# Altium schematic sheet USB To Serial.SchDoc
size A
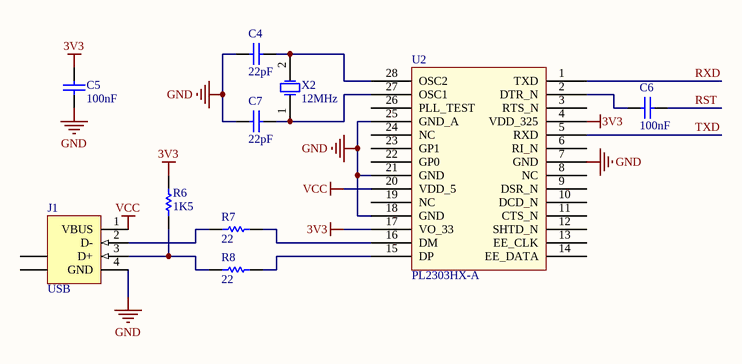
[diagram p0: USB To Serial.SchDoc]

## Parts
C4  22pF  [C0805]
C5  100nF  [C0805]
C6  100nF  [C0805]
C7  22pF  [C0805]
J1  USB  [HDR1X4]
R6  1K5  [R0805]
R7  22  [R0805]
R8  22  [R0805]
U2  PL2303HX-A  [SSOP-28]
X2  12MHz  [HC49US]

## Nets
3V3: C5.2 R6.2 U2.4(VDD_325) U2.17(VO_33)
GND: C4.1 C5.1 C7.1 J1.4(GND) U2.7(GND) U2.18(GND) U2.21(GND) U2.25(GND_A)
VCC: J1.1(VBUS) U2.20(VDD_5)
RST: C6.1
RXD: U2.1(TXD)
TXD: U2.5(RXD)
NetC4_2: C4.2 U2.28(OSC2) X2.2(OSC2)
NetC6_2: C6.2 U2.2(DTR_N)
NetC7_2: C7.2 U2.27(OSC1) X2.1(OSC1)
NetJ1_2: J1.2(D-) R7.1
NetJ1_3: J1.3(D+) R6.1 R8.1
NetR7_2: R7.2 U2.16(DM)
NetR8_2: R8.2 U2.15(DP)

Not connected (* = marked no-connect by the designer): J1 5(SHLD) 6(SHLD); U2 3(RTS_N) 6(RI_N) 8(NC) 9(DSR_N) 10(DCD_N) 11(CTS_N) 12(SHTD_N) 13(EE_CLK) 14(EE_DATA) 19(NC) 22(GP0) 23(GP1) 24(NC) 26(PLL_TEST)

## Library data of the parts
C4-C7 = Cap: Capacitor; Published: 8-Jun-2000; LatestRevisionDate: 17-Jul-2002; LatestRevisionNote: Re-released for DXP Platform.; PackageReference: RAD-0.3; Publisher: Altium Limited; PackageDescription: Radial Cap, Thru-Hole; 2 Leads; 0.3 in Pin Spacing
  C4 C7: Value: 22pF
  C5 C6: Value: 100nF
J1 = USB: Value: Type B; Category: Connector; Type: USB; Price: 2250; Link: http://www.sfe-electronics.com/product.php?category=12&product_id=156
R6-R8 = Res1: Resistor; Published: 8-Jun-2000; LatestRevisionDate: 17-Jul-2002; LatestRevisionNote: Re-released for DXP Platform.; PackageReference: AXIAL-0.3; Publisher: Altium Limited; PackageDescription: Axial Device, Thru-Hole; 2 Leads; 0.3 in Pin Spacing
  R6: Value: 1K5
  R7 R8: Value: 22
U2 = PL2303HX Rev. A: Value: PL2303HX-A
X2 = XTAL: Crystal Oscillator; Published: 8-Jun-2000; LatestRevisionDate: 17-Jul-2002; LatestRevisionNote: Re-released for DXP Platform.; PackageReference: R38; Publisher: Altium Limited; PackageDescription: Crystal, Thru-Hole; 2 Leads; Body 3.1 x 8.2 mm (Dia.xH); Value: 12MHz